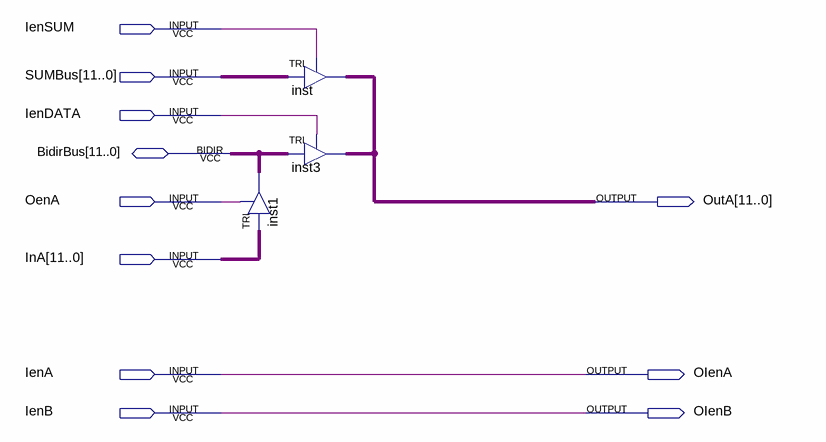
[diagram p0: schematic sheet]
// Quartus schematic contador_UC.bdf as structural Verilog: 3 symbols, 11 pins
module contador_UC (
  input  IenSUM,
  input  [11:0] SUMBus,
  input  IenDATA,
  input  OenA,
  input  [11:0] InA,
  input  IenA,
  input  IenB,
  inout  [11:0] BidirBus,
  output [11:0] OutA,
  output OIenA,
  output OIenB
);

  TRI inst1[11:0] (.IN(InA), .OE(OenA), .OUT(BidirBus));
  TRI inst[11:0] (.IN(SUMBus), .OE(IenSUM), .OUT(OutA));
  TRI inst3[11:0] (.IN(BidirBus), .OE(IenDATA), .OUT(OutA));

  assign OIenA = IenA;
  assign OIenB = IenB;
endmodule
